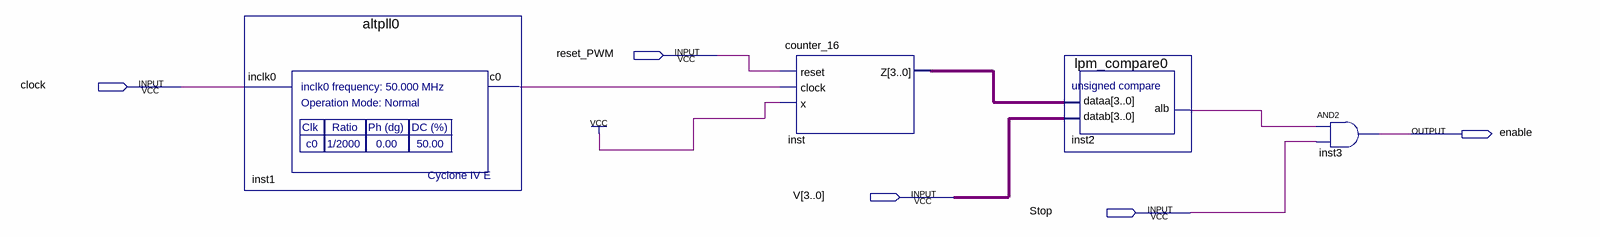
[diagram p0: schematic sheet]
// Quartus schematic velocimetro.bdf as structural Verilog: 4 symbols, 5 pins
module velocimetro (
  input  reset_PWM,
  input  clock,
  input  [3:0] V,
  input  Stop,
  output enable
);

  wire inst1_c0, inst2_alb;
  wire [3:0] inst_z;

  altpll0 inst1 (.inclk0(clock), .c0(inst1_c0));
  counter_16 inst (.reset(reset_PWM), .clock(inst1_c0), .x(1'b1), .Z(inst_z));
  lpm_compare0 inst2 (.dataa(inst_z), .datab(V), .alb(inst2_alb));
  and inst3 (enable, inst2_alb, Stop);
endmodule
